# EAGLE design VocoreBaseShield (EAGLE 6.5.0)
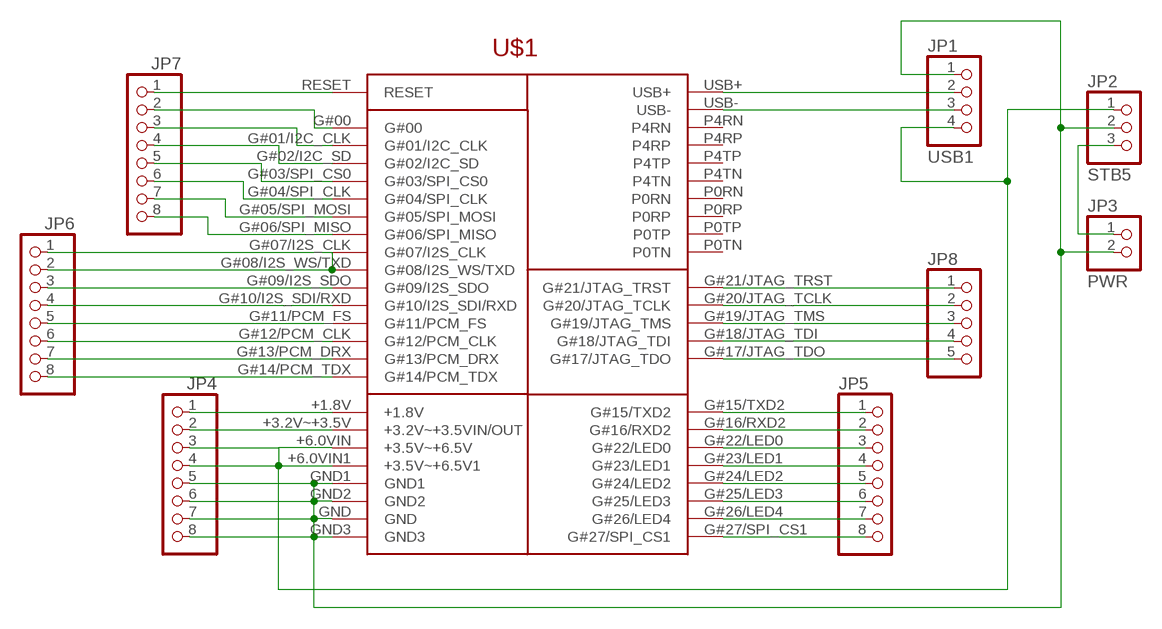
[diagram p0: schematic, sheet 1]

## Parts
JP1  USB1  PINHD-1X4  [1X04]
JP2  STB5  PINHD-1X3  [1X03]
JP3  PWR  PINHD-1X2  [1X02]
JP4  PINHD-1X8  [1X08]
JP5  PINHD-1X8  [1X08]
JP6  PINHD-1X8  [1X08]
JP7  PINHD-1X8  [1X08]
JP8  PINHD-1X5  [1X05]
U$1  VOCORE_SHIELD  [VOCORE_DOC_CUSTOM]

## Nets
N$1: JP1.1 JP2.2 JP3.2 JP4.5 JP4.6 JP4.7 JP4.8 U$1.GND U$1.GND1 U$1.GND2 U$1.GND3
N$2: JP2.3 JP3.1
N$3: JP1.4 JP2.1 JP4.3 JP4.4 U$1.+6.0VIN1(+3.5V~+6.5V1) U$1.+6.0VIN(+3.5V~+6.5V)
N$4: JP4.1 U$1.+1.8V
N$5: JP1.3 U$1.USB-
N$6: JP1.2 U$1.USB+
N$7: JP4.2 U$1.+3.2V~+3.5V(+3.2V~+3.5VIN/OUT)
N$8: JP5.1 U$1.G#15/TXD2
N$9: JP5.2 U$1.G#16/RXD2
N$10: JP5.3 U$1.G#22/LED0
N$11: JP5.4 U$1.G#23/LED1
N$12: JP5.5 U$1.G#24/LED2
N$13: JP5.6 U$1.G#25/LED3
N$14: JP5.7 U$1.G#26/LED4
N$15: JP5.8 U$1.G#27/SPI_CS1
N$16: JP6.8 U$1.G#14/PCM_TDX
N$17: JP6.7 U$1.G#13/PCM_DRX
N$18: JP6.6 U$1.G#12/PCM_CLK
N$19: JP6.5 U$1.G#11/PCM_FS
N$20: JP6.4 U$1.G#10/I2S_SDI/RXD
N$21: JP6.3 U$1.G#09/I2S_SDO
N$22: JP6.1 JP6.2 U$1.G#08/I2S_WS/TXD
N$23: JP7.1 U$1.RESET
N$24: JP7.2 U$1.G#00
N$25: JP7.3 U$1.G#01/I2C_CLK
N$26: JP7.4 U$1.G#02/I2C_SD
N$27: JP7.5 U$1.G#03/SPI_CS0
N$28: JP7.6 U$1.G#04/SPI_CLK
N$29: JP7.7 U$1.G#05/SPI_MOSI
N$30: JP7.8 U$1.G#06/SPI_MISO
N$31: JP8.2 U$1.G#20/JTAG_TCLK
N$32: U$1.G#19/JTAG_TMS
N$33: JP8.4 U$1.G#18/JTAG_TDI
N$34: JP8.1 U$1.G#21/JTAG_TRST
N$35: JP8.5 U$1.G#17/JTAG_TDO
Unconnected: JP8.3 U$1.G#07/I2S_CLK U$1.P0RN U$1.P0RP U$1.P0TN U$1.P0TP U$1.P4RN U$1.P4RP U$1.P4TN U$1.P4TP

## Library data of the parts
JP1 = pinhead:PINHD-1X4: PIN HEADER
JP2 = pinhead:PINHD-1X3: PIN HEADER
JP3 = pinhead:PINHD-1X2: PIN HEADER
JP4-JP7 = pinhead:PINHD-1X8: PIN HEADER
JP8 = pinhead:PINHD-1X5: PIN HEADER
U$1 = Vocore:VOCORE_SHIELD

## Board
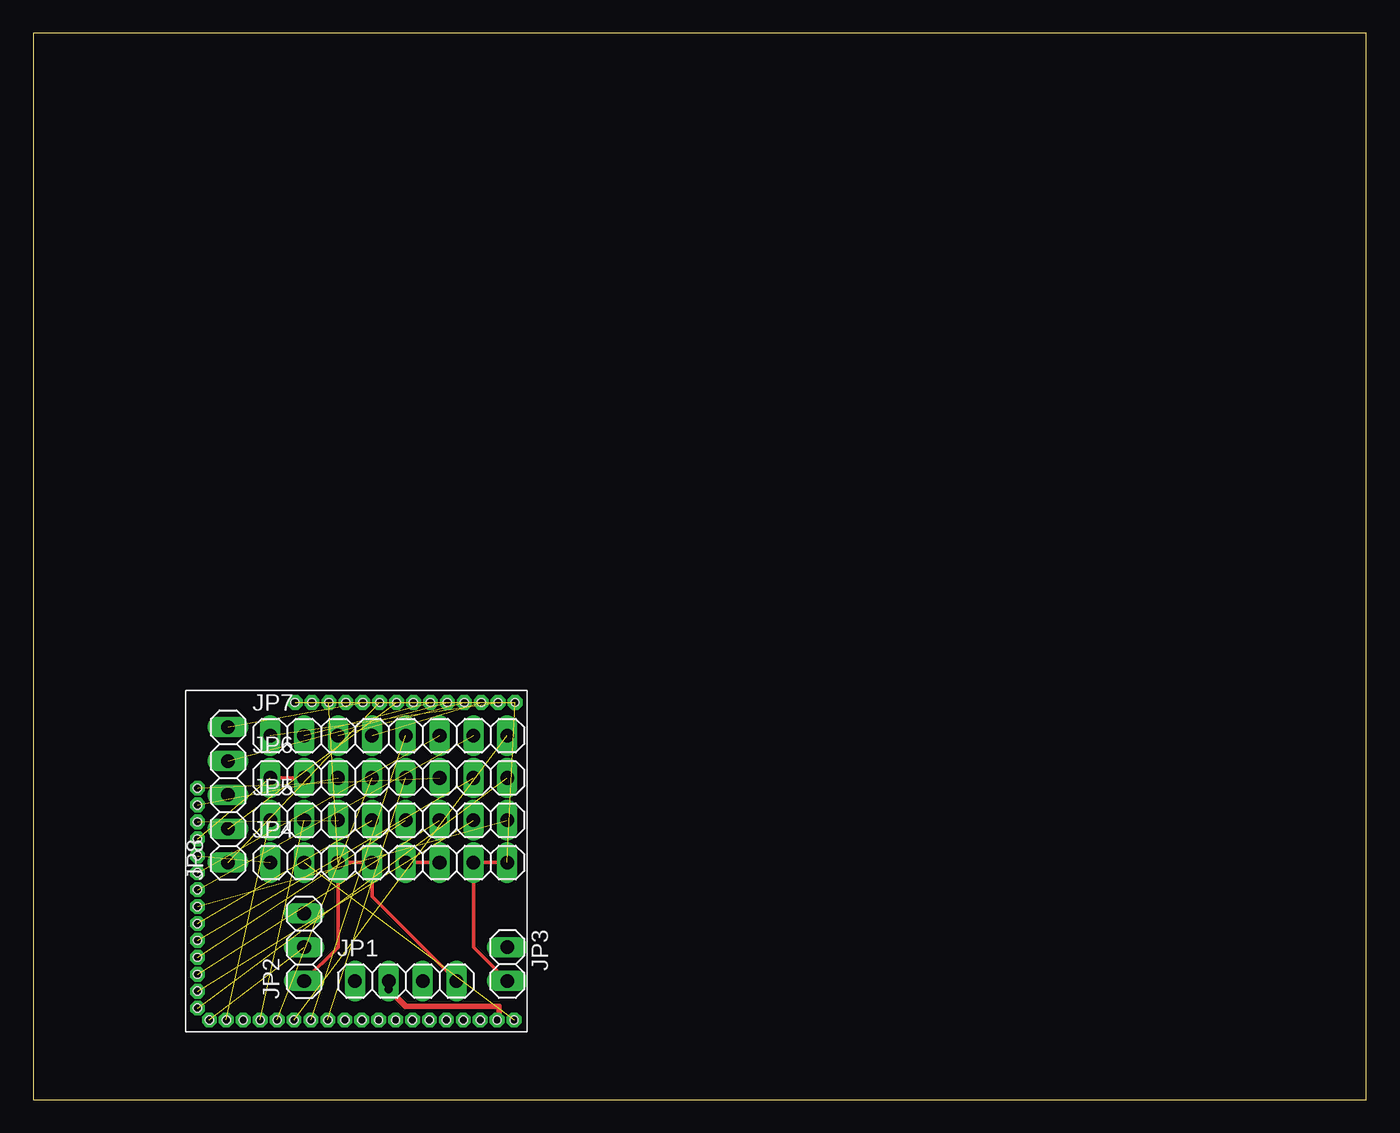
[diagram p1: board, top side]
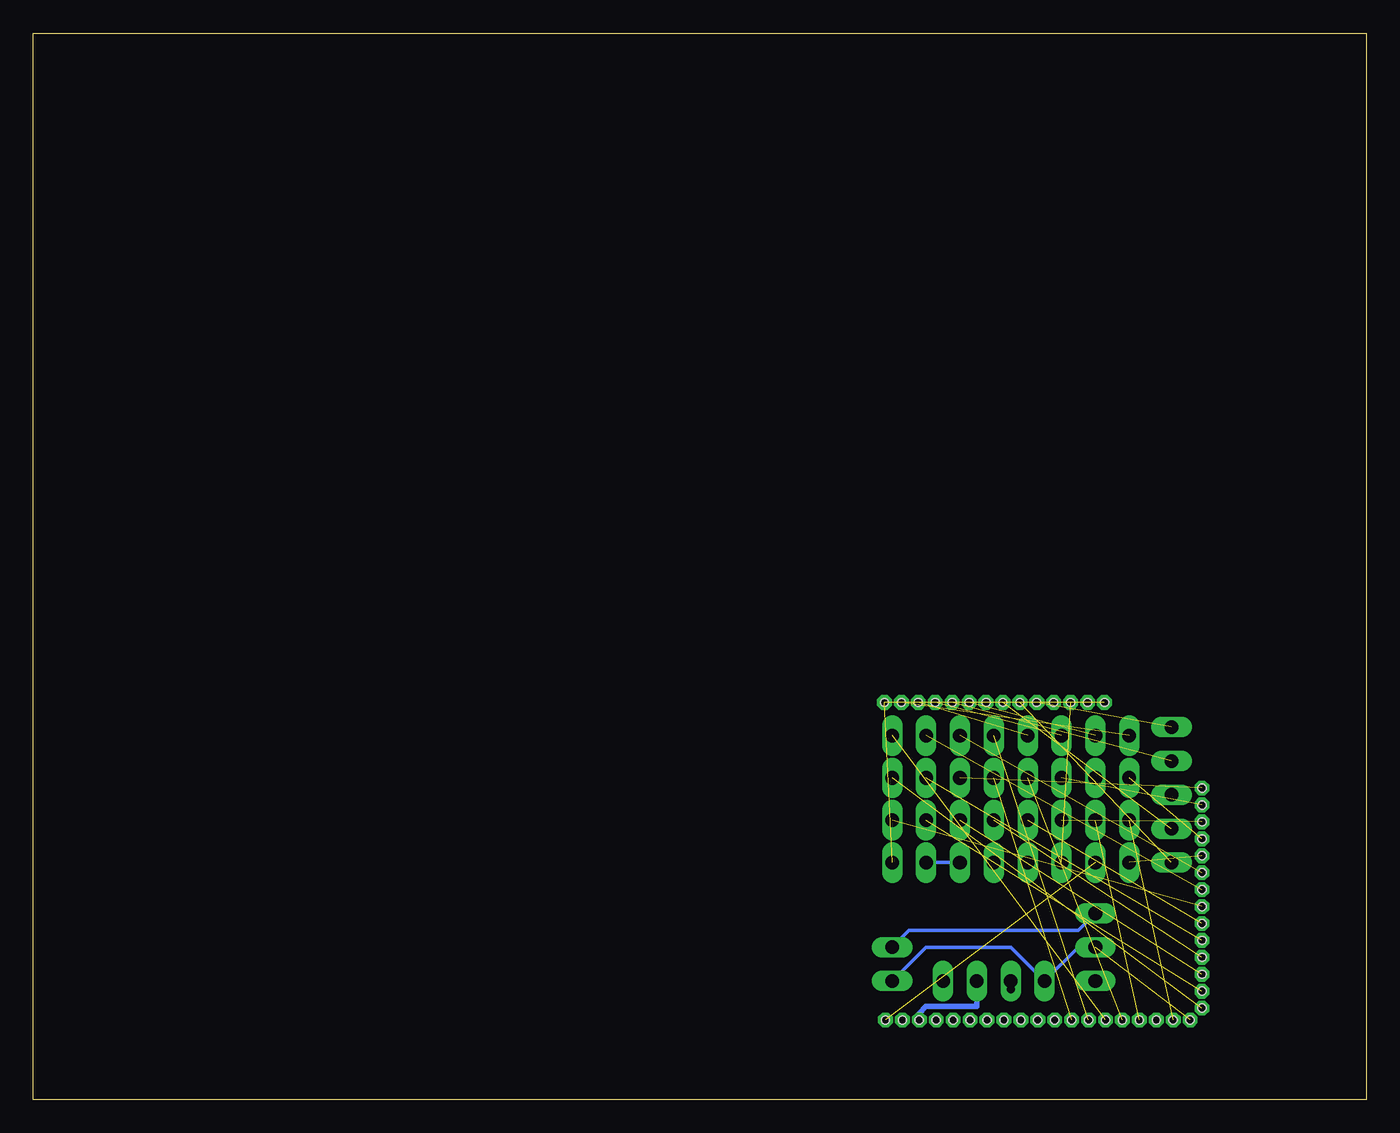
[diagram p2: board, bottom side, seen from below]

Size 100 x 80 mm. Coordinates in mm from the lower left corner, seen from the top.
Outline: 0,0 100,0 100,80 0,80 0,0
Copper layers (1*16): Top 0.035mm / dielectric 1.5mm / Bottom 0.035mm
Design rules "default": minimum track width 10mil, minimum drill 24mil, track to track 8mil, track to pad 8mil, pad to pad 8mil, via to via 8mil, smd to smd 8mil, copper to edge 40mil, drill to drill 8mil, minimum pad ring 10mil, minimum via ring 8mil, stop-mask expansion 4mil, vias tented up to drill 0mil, thermal gap 10mil

### Footprints (pad centres in the part's own frame; a part is rotated, then mirrored left to right if it is on the bottom)
1X04 = drill 1.016 long: 1 -3.81,0; 2 -1.27,0; 3 1.27,0; 4 3.81,0
1X03 = drill 1.016 long: 1 -2.54,0; 2 0,0; 3 2.54,0
1X02 = drill 1.016 long: 1 -1.27,0; 2 1.27,0
1X08 = drill 1.016 long: 1 -8.89,0; 2 -6.35,0; 3 -3.81,0; 4 -1.27,0; 5 1.27,0; 6 3.81,0; 7 6.35,0; 8 8.89,0
1X05 = drill 1.016 long: 1 -5.08,0; 2 -2.54,0; 3 0,0; 4 2.54,0; 5 5.08,0
VOCORE_DOC_CUSTOM = drill 0.6 pad 0.889 octagon: +1.8V 0.889,13.208; +3.2V~+3.5V 24.638,0.889; +6.0VIN 9.474,24.714; +6.0VIN1 10.744,24.714; G#00 18.364,24.714; G#01/I2C_CLK 20.904,24.714; G#02/I2C_SD 22.174,24.714; G#03/SPI_CS0 9.398,0.889; G#04/SPI_CLK 0.889,11.938; G#05/SPI_MOSI 0.889,10.668; G#06/SPI_MISO 8.128,0.889; G#07/I2S_CLK 4.318,0.889; G#08/I2S_WS/TXD 0.889,14.478; G#09/I2S_SDO 0.889,17.018; G#10/I2S_SDI/RXD 6.858,0.889; G#11/PCM_FS 10.668,0.889; G#12/PCM_CLK 0.889,18.288; G#13/PCM_DRX 0.889,6.858; G#14/PCM_TDX 0.889,1.778; G#15/TXD2 3.048,0.889; G#16/RXD2 5.588,0.889; G#17/JTAG_TDO 13.284,24.714; G#18/JTAG_TDI 19.634,24.714; G#19/JTAG_TMS 17.094,24.714; G#20/JTAG_TCLK 15.824,24.714; G#21/JTAG_TRST 14.554,24.714; G#22/LED0 0.889,15.748; G#23/LED1 0.889,8.128; G#24/LED2 0.889,5.588; G#25/LED3 0.889,4.318; G#26/LED4 0.889,3.048; G#27/SPI_CS1 0.889,9.398; GND 24.714,24.714; GND1 12.014,24.714; GND2 8.204,24.714; GND3 1.778,0.889; P0RN 15.748,0.889; P0RP 14.478,0.889; P0TN 11.938,0.889; P0TP 13.208,0.889; P4RN 20.828,0.889; P4RP 19.558,0.889; P4TN 17.018,0.889; P4TP 18.288,0.889; RESET 23.444,24.714; USB+ 23.368,0.889; USB- 22.098,0.889 | hole 0.6: 0.889,1.778; 0.889,3.048; 0.889,4.318; 0.889,5.588; 0.889,6.858; 0.889,8.128; 0.889,9.398; 0.889,10.668; 0.889,11.938; 0.889,13.208; 0.889,14.478; 0.889,15.748; 0.889,17.018; 0.889,18.288; 8.204,24.714; 24.714,24.714; 23.444,24.714; 22.174,24.714; 20.904,24.714; 19.634,24.714; 18.364,24.714; 17.094,24.714; 15.824,24.714; 14.554,24.714; 13.284,24.714; 12.014,24.714; 10.744,24.714; 9.474,24.714; 1.778,0.889; 18.288,0.889; 17.018,0.889; 15.748,0.889; 14.478,0.889; 13.208,0.889; 11.938,0.889; 10.668,0.889; 9.398,0.889; 8.128,0.889; 6.858,0.889; 5.588,0.889; 4.318,0.889; 3.048,0.889; 24.638,0.889; 23.368,0.889; 22.098,0.889; 20.828,0.889; 19.558,0.889

### Placement (x,y rotation side)
JP1  27.94,8.89 0 top
JP2  20.32,11.43 90 top
JP3  35.56,10.16 270 top
JP4  26.67,17.78 0 top
JP5  26.67,20.95 0 top
JP6  26.67,24.13 0 top
JP7  26.67,27.3 0 top
JP8  14.61,22.86 90 top
U$1  11.43,5.08 0 top

### Tracks (layer width: path | path; a pad name or v marks a point on that pad's centre or on a via)
N$1  (4 unrouted)
  Top 0.254: JP4.6 JP4.5 | JP3.2 33.02,11.43 JP4.7 JP4.8
  Bottom 0.254: JP2.2 21.59,11.43 JP1.1 26.67,11.43 33.02,11.43 JP3.2 | JP4.6 JP4.7
N$2
  Bottom 0.254: JP2.3 21.59,12.7 34.29,12.7 JP3.1
N$3  (2 unrouted)
  Top 0.254: JP2.1 22.86,11.43 JP4.3 JP4.4 25.4,15.24 JP1.4
N$4  (1 unrouted)
N$5
  Bottom 0.406: U$1.USB- 33.53,6.48 33.02,6.99 29.21,6.99 JP1.3
N$6  (via drill 0.6)
  Top 0.406: v26.67,8.26 27.94,6.99 34.92,6.99 34.92,6.1 U$1.USB+
  Bottom 0.406: JP1.2 v26.67,8.26
N$7  (1 unrouted)
N$8  (1 unrouted)
N$9  (1 unrouted)
N$10  (1 unrouted)
N$11  (1 unrouted)
N$12  (1 unrouted)
N$13  (1 unrouted)
N$14  (1 unrouted)
N$15  (1 unrouted)
N$16  (1 unrouted)
N$17  (1 unrouted)
N$18  (1 unrouted)
N$19  (1 unrouted)
N$20  (1 unrouted)
N$21  (1 unrouted)
N$22  (1 unrouted)
  Top 0.254: JP6.2 JP6.1
N$23  (1 unrouted)
N$24  (1 unrouted)
N$25  (1 unrouted)
N$26  (1 unrouted)
N$27  (1 unrouted)
N$28  (1 unrouted)
N$29  (1 unrouted)
N$30  (1 unrouted)
N$31  (1 unrouted)
N$33  (1 unrouted)
N$34  (1 unrouted)
N$35  (1 unrouted)